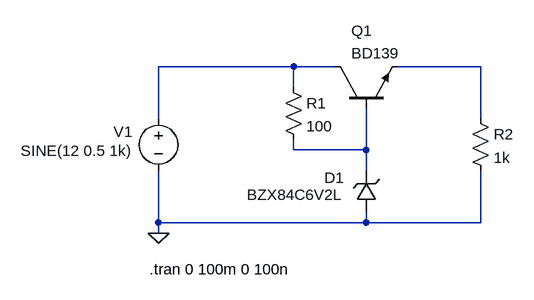
[diagram p0: schematic BD139_Regulator.asc]
BD139_Regulator.asc, the LTspice schematic file:
Version 4
SHEET 1 880 680
WIRE 16 96 -192 96
WIRE 80 96 16 96
WIRE 304 96 176 96
WIRE 16 128 16 96
WIRE -192 176 -192 96
WIRE 304 176 304 96
WIRE 16 224 16 208
WIRE 128 224 128 160
WIRE 128 224 16 224
WIRE 128 256 128 224
WIRE -192 336 -192 256
WIRE 128 336 128 320
WIRE 128 336 -192 336
WIRE 304 336 304 256
WIRE 304 336 128 336
WIRE -192 352 -192 336
FLAG -192 352 0
SYMBOL npn 80 160 R270
WINDOW 0 119 25 VRight 2
WINDOW 3 85 25 VRight 2
SYMATTR InstName Q1
SYMATTR Value BD139
SYMBOL res 0 112 R0
SYMATTR InstName R1
SYMATTR Value 100
SYMBOL zener 144 320 R180
WINDOW 0 50 53 Left 2
WINDOW 3 53 27 Left 2
SYMATTR InstName D1
SYMATTR Value BZX84C6V2L
SYMATTR Description Diode
SYMATTR Type diode
SYMBOL voltage -192 160 R0
WINDOW 0 -69 36 Left 2
WINDOW 3 -212 65 Left 2
WINDOW 123 0 0 Left 0
WINDOW 39 0 0 Left 0
SYMATTR InstName V1
SYMATTR Value SINE(12 0.5 1k)
SYMBOL res 288 160 R0
SYMATTR InstName R2
SYMATTR Value 1k
TEXT -206 408 Left 2 !.tran 0 100m 0 100n

The netlist it stands for:
* BD139_Regulator.asc
Q1 N001 N003 N002 0 BD139
R1 N001 N003 100
D1 0 N003 BZX84C6V2L
V1 N001 0 SINE(12 0.5 1k)
R2 N002 0 1k
.model D D
.lib standard.dio
.model NPN NPN
.model PNP PNP
.lib standard.bjt
.tran 0 100m 0 100n
.backanno
.end